# EAGLE schematic respirho2pilev2 (EAGLE 9.6.2)
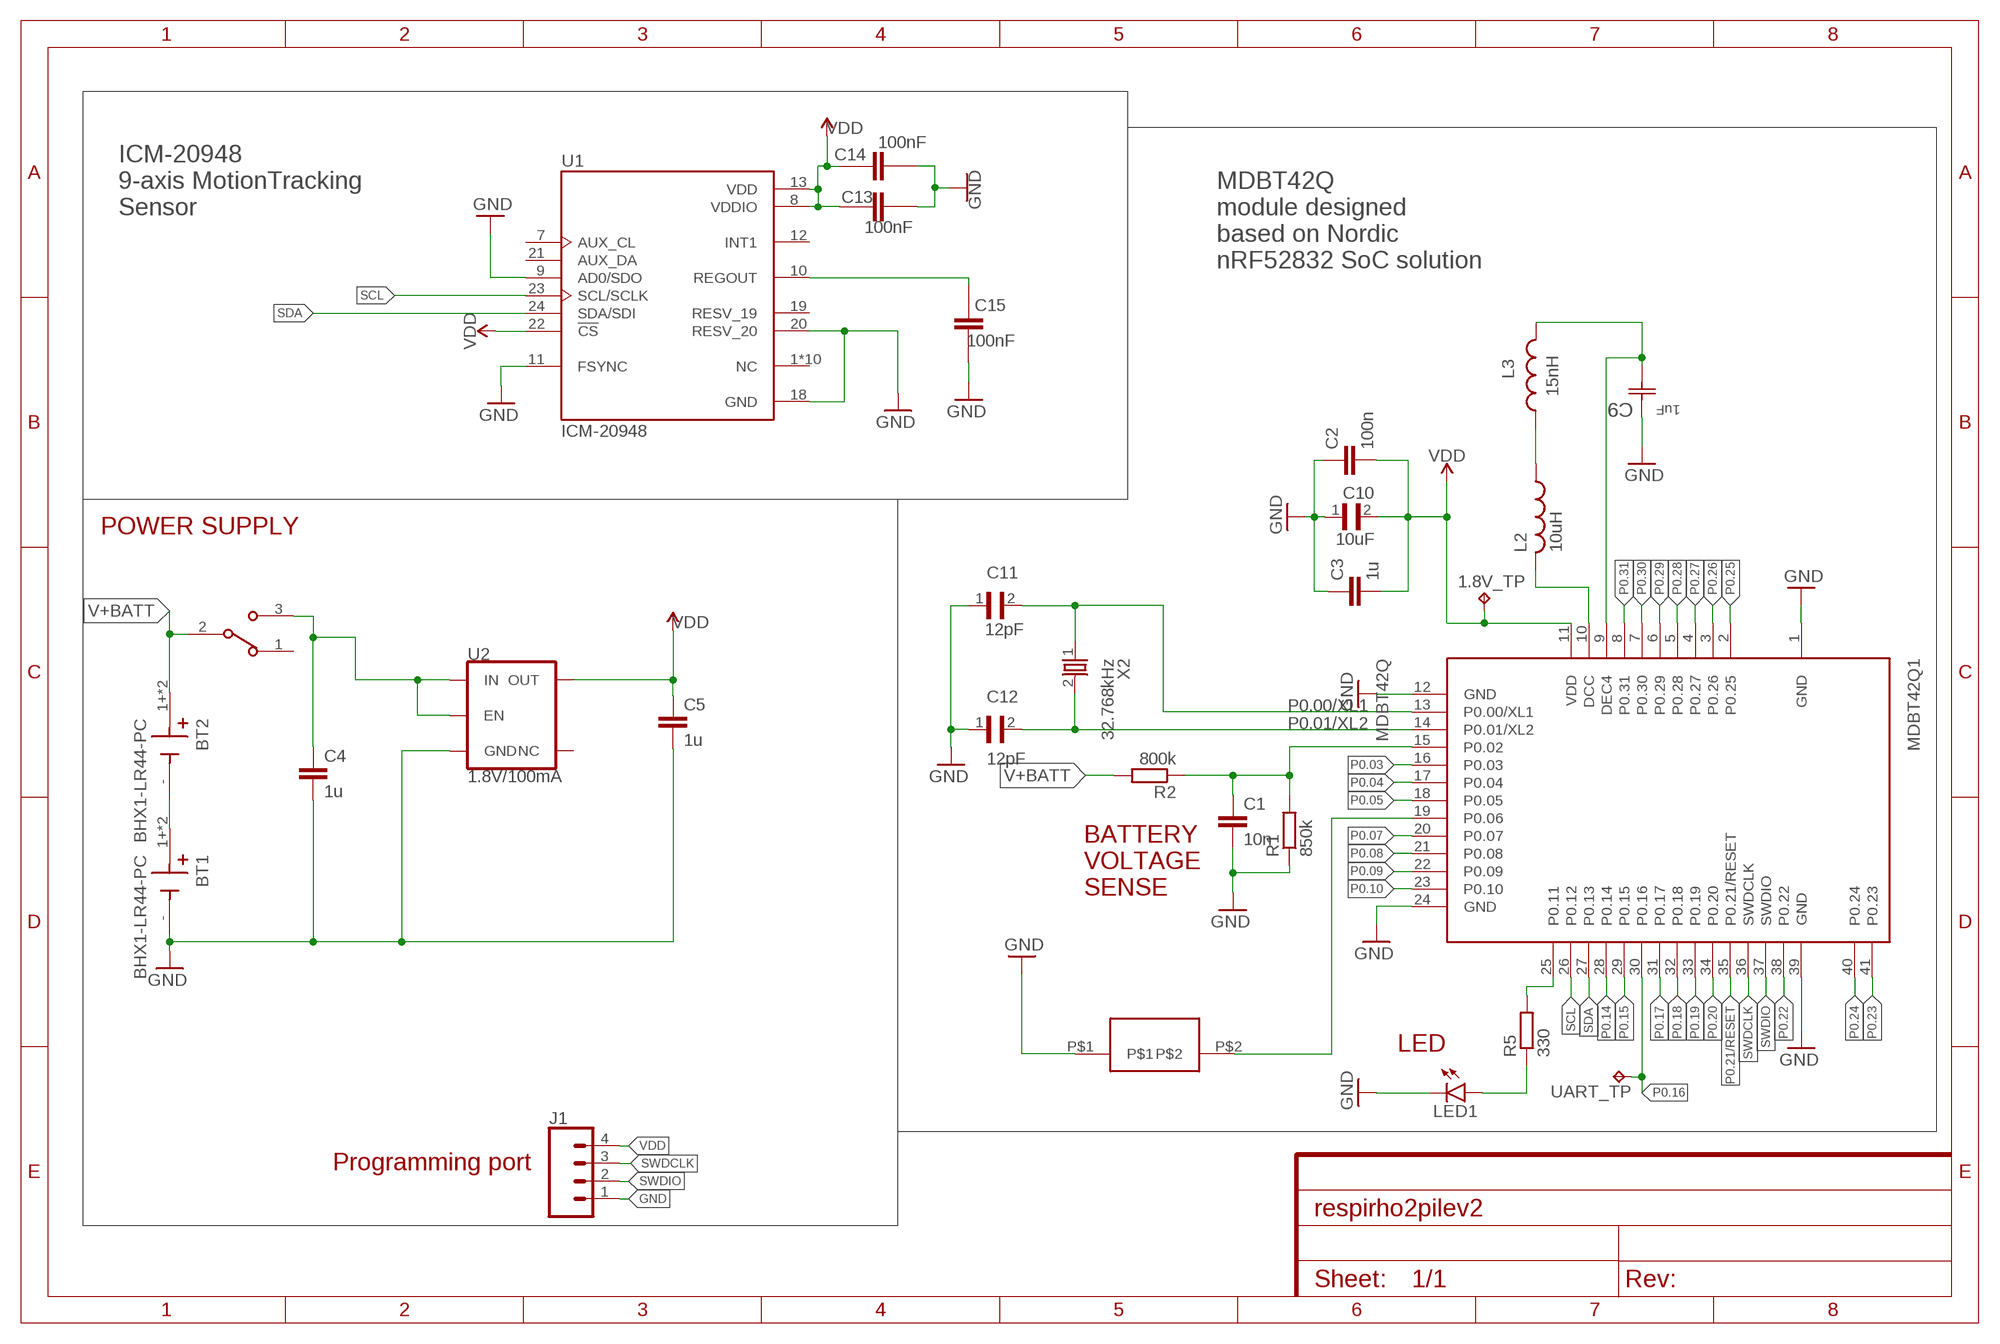
[diagram p0: schematic, sheet 1]

## Parts
1.8V_TP  TPB1,27  [B1,27]
BT1  BHX1-LR44-PC  [BAT_BHX1-LR44-PC]
BT2  BHX1-LR44-PC  [BAT_BHX1-LR44-PC]
C1  10n  C-EUC0603  [C0603]
C2  100n  C-EUC0402  [C0402]
C3  1u  C-EUC0603  [C0603]
C4  1u  C-EUC0402  [C0402]
C5  1u  C-EUC0402  [C0402]
C9  1uF  CC0603KRX7R7BB105  [CAPC1608X90N]
C10  10uF  GRM188R61A106KE69J  [CAPC1608X95N]
C11  12pF  04025A120GAT2A  [CAPC1005X56N]
C12  12pF  04025A120GAT2A  [CAPC1005X56N]
C13  100nF  CC0402KRX7R6BB104  [CAPC1005X60]
C14  100nF  CC0402KRX7R6BB104  [CAPC1005X60]
C15  100nF  CC0402KRX7R6BB104  [CAPC1005X60]
J1  CONN_04PTH  [1X04]
L2  10uH  INDUCTOR_0603_L  [RESC0603_L]
L3  15nH  LQG15HS15NJ02D  [INDC1005X55N]
LED1  LEDCHIPLED_1206  [CHIPLED_1206]
MDBT42Q1  MDBT42Q  [MDBT42Q]
R1  850k  R-EU_R0603  [R0603]
R2  800k  R-EU_R0603  [R0603]
R5  330  R-EU_R0603  [R0603]
S2  EG1213  [SW_EG1213]
U1  ICM-20948  [QFN40P300X300X105-24N]
U2  1.8V/100mA  V_REG_SP6214-1.8V  [SC70]
U$1  KSS231GLFS  [KSS231GLFS]
UART_TP  TPB1,27  [B1,27]
X2  32.768kHz  XTAL_32KHZ  [XTAL_3215_N]

## Nets
GND: BT1.- C1.2 C2.1 C3.1 C4.2 C5.2 C9.1(C1) C10.1 C11.1 C12.1 C13.1 C14.1 C15.1 J1.1 LED1.C MDBT42Q1.1(GND) MDBT42Q1.12(GND) MDBT42Q1.24(GND) MDBT42Q1.39(GND) R1.1 U1.9(AD0/SDO) U1.11(FSYNC) U1.18(GND) U1.20(RESV_20) U2.2(GND) U$1.P$1
N$1: LED1.A R5.1
N$2: L2.2 MDBT42Q1.10(DCC)
N$3: L2.1 L3.1
N$4: C9.2(C2) L3.2 MDBT42Q1.9(DEC4)
N$5: MDBT42Q1.25(P0.11) R5.2
N$6: BT1.1+(+) BT1.2+(+) BT2.-
N$7: C15.2 U1.10(REGOUT)
N$8: C4.1 S2.3 U2.1(IN) U2.3(EN)
N$9: C1.1 MDBT42Q1.15(P0.02) R1.2 R2.1
P0.00/XL1: C11.2 MDBT42Q1.13(P0.00/XL1) X2.1
P0.01/XL2: C12.2 MDBT42Q1.14(P0.01/XL2) X2.2
P0.03: MDBT42Q1.16(P0.03)
P0.04: MDBT42Q1.17(P0.04)
P0.05: MDBT42Q1.18(P0.05)
P0.07: MDBT42Q1.20(P0.07)
P0.08: MDBT42Q1.21(P0.08)
P0.09: MDBT42Q1.22(P0.09)
P0.10: MDBT42Q1.23(P0.10)
P0.14: MDBT42Q1.28(P0.14)
P0.15: MDBT42Q1.29(P0.15)
P0.16: MDBT42Q1.30(P0.16) UART_TP.TP
P0.17: MDBT42Q1.31(P0.17)
P0.18: MDBT42Q1.32(P0.18)
P0.19: MDBT42Q1.33(P0.19)
P0.20: MDBT42Q1.34(P0.20)
P0.21/RESET: MDBT42Q1.35(P0.21/RESET)
P0.22: MDBT42Q1.38(P0.22)
P0.23: MDBT42Q1.41(P0.23)
P0.24: MDBT42Q1.40(P0.24)
P0.25: MDBT42Q1.2(P0.25)
P0.26: MDBT42Q1.3(P0.26)
P0.27: MDBT42Q1.4(P0.27)
P0.28: MDBT42Q1.5(P0.28)
P0.29: MDBT42Q1.6(P0.29)
P0.30: MDBT42Q1.7(P0.30)
P0.31: MDBT42Q1.8(P0.31)
P06: MDBT42Q1.19(P0.06) U$1.P$2
SCL: MDBT42Q1.26(P0.12) U1.23(SCL/SCLK)
SDA: MDBT42Q1.27(P0.13) U1.24(SDA/SDI)
SWDCLK: J1.3 MDBT42Q1.36(SWDCLK)
SWDIO: J1.2 MDBT42Q1.37(SWDIO)
V+BATT: BT2.1+(+) BT2.2+(+) R2.2 S2.2
VDD: 1.8V_TP.TP C2.2 C3.2 C5.1 C10.2 C13.2 C14.2 J1.4 MDBT42Q1.11(VDD) U1.8(VDDIO) U1.13(VDD) U1.22(!CS) U2.5(OUT)
Unconnected: S2.1 U1.1(NC) U1.2(NC) U1.3(NC) U1.4(NC) U1.5(NC) U1.6(NC) U1.7(AUX_CL) U1.12(INT1) U1.14(NC) U1.15(NC) U1.16(NC) U1.17(NC) U1.19(RESV_19) U1.21(AUX_DA) U2.4(NC)

## Notes on the sheet
- ICM-20948
  9-axis MotionTracking
  Sensor
- MDBT42Q
  module designed 
  based on Nordic 
  nRF52832 SoC solution
- POWER SUPPLY
- BATTERY
  VOLTAGE
  SENSE
- LED
- Programming port

## Library data of the parts
1.8V_TP UART_TP = testpad:TP: Test pad
BT1 BT2 = BHX1-LR44-PC:BHX1-LR44-PC: Battery Retainer Coin, 12.0mm 1 Cell PC Pin; DESCRIPTION: Battery Retainer Coin, 12.0mm 1 Cell PC Pin; DIGI-KEY_PART_NUMBER: BHX1-LR44-PC-G-ND; MF: MPD; MP: BHX1-LR44-PC; PACKAGE: None; PURCHASE-URL: https://pricing.snapeda.com/search/part/BHX1-LR44-PC/?ref=eda
C1-C5 = rcl:C-EU: CAPACITOR, European symbol; SPICEPREFIX: C
C9 = CC0603KRX7R7BB105:CC0603KRX7R7BB105: CAPACITOR, 0603; DESCRIPTION: 0603 1 uF 16 V ±10 % Tolerance X7R SMT Multilayer Ceramic Capacitor; DIGI-KEY_PART_NUMBER: 311-1446-1-ND; DIGI-KEY_PURCHASE_URL: https://www.digikey.com/product-detail/en/yageo/CC0603KRX7R7BB105/311-1446-1-ND/2833752?utm_source=snapeda&utm_medium=aggregator&utm_campaign=symbol; MF: Yageo; MP: CC0603KRX7R7BB105; PACKAGE: 0603 Yageo
C10 = GRM188R61A106KE69J:GRM188R61A106KE69J: Cap Ceramic 10uF 10V X5R 10% SMD 0603 85°C Paper T/R; DESCRIPTION: SMD Capacitor X5R_EIA_ with Capacitance: 10uF Tol. 10%. Rated Voltage: 10Vdc; DIGI-KEY_PART_NUMBER: 490-14372-1-ND; DIGI-KEY_PURCHASE_URL: https://www.digikey.com/product-detail/en/murata-electronics/GRM188R61A106KE69J/490-14372-1-ND/6606833?utm_source=snapeda&utm_medium=aggregator&utm_campaign=symbol; MF: Murata; MP: GRM188R61A106KE69J; PACKAGE: 1608 Murata
C11 C12 = 04025A120GAT2A:04025A120GAT2A: CAP, MLCC, C0G, 12PF, 50V, 0402; DESCRIPTION: 0402 12 pF 50 V ±2% Tolerance C0G/NP0 SMT Multilayer Ceramic Capacitor; DIGI-KEY_PART_NUMBER: 478-7871-1-ND; DIGI-KEY_PURCHASE_URL: https://www.digikey.com/product-detail/en/avx-corporation/04025A120GAT2A/478-7871-1-ND/3881494?utm_source=snapeda&utm_medium=aggregator&utm_campaign=symbol; MF: AVX; MP: 04025A120GAT2A; PACKAGE: 1005 AVX
C13-C15 = CC0402KRX7R6BB104:CC0402KRX7R6BB104: Capacitor 100nF 10V 0402 SMD X7R (reel); DESCRIPTION: 0.1µF ±10% 10V Ceramic Capacitor X7R 0402 _1005 Metric_; DIGI-KEY_PART_NUMBER: 311-1345-1-ND; DIGI-KEY_PURCHASE_URL: https://www.digikey.com/product-detail/en/yageo/CC0402KRX7R6BB104/311-1345-1-ND/2103129?utm_source=snapeda&utm_medium=aggregator&utm_campaign=symbol; MF: Yageo; MP: CC0402KRX7R6BB104; PACKAGE: 0402 Yageo
J1 = SparkFun-Connectors:CONN_04: Multi connection point. Often used as Generic Header-pin footprint for 0.1 inch spaced/style header connections On any of the 0.1 inch spaced packages, you can populate with these: Break Away Headers - Straight <https://www.sparkfun.com/products/116> (PRT-00116) Break Away Male Headers - Right Angle <https://www.sparkfun.com/products/553> (PRT-00553) Female Headers <https://www.sparkfun.com/products/115> (PRT-00115) Break Away Headers - Machine Pin <https://www.sparkfun.com/products/117> (PRT-00117) Break Away Female Headers - Swiss Machine Pin <https://www.sparkfun.com/products/743> (PRT-00743) For SCREWTERMINALS and SPRING TERMINALS visit here: Screw Terimnals on SparkFun.com <https://www.sparkfun.com/search/results?term=Screw+Terminals> (5mm/3.5mm/2.54mm spacing) This device is also useful as a general connection point to wire up your design to another part of your project. Our various solder wires solder well into these plated through hole pads. Hook-Up Wire - Assortment (Stranded, 22 AWG) <https://www.sparkfun.com/products/11375> (PRT-11375) Hook-Up Wire - Assortment (Solid Core, 22 AWG) <https://www.sparkfun.com/products/11367> (PRT-11367) View the entire wire category on our website here <https://www.sparkfun.com/categories/141> Special notes: Molex polarized connector foot print use with SKU : PRT-08231 with associated crimp pins and housings. 1MM SMD Version SKU: PRT-10208; PROD_ID: CONN-09696
L2 = Nordic_nRF:INDUCTOR: Generic chip inductor
L3 = LQG15HS15NJ02D:LQG15HS15NJ02D: Ind RF Chip Multi-Layer 15nH 5% 100MHz 8Q-Factor Air 300mA 0402 Paper T/R; DESCRIPTION: Inductor with Inductance: 15nH Tol. +/-5%, Package: 0402 _1005_; DIGI-KEY_PART_NUMBER: 490-2625-1-ND; DIGI-KEY_PURCHASE_URL: https://www.digikey.com/product-detail/en/murata-electronics/LQG15HS15NJ02D/490-2625-1-ND/662905?utm_source=snapeda&utm_medium=aggregator&utm_campaign=symbol; MF: Murata Electronics; MP: LQG15HS15NJ02D; PACKAGE: 1005 Murata
LED1 = led:LED: LED OSRAM: - CHIPLED LG R971, LG N971, LY N971, LG Q971, LY Q971, LO R971, LY R971 LH N974, LH R974 LS Q976, LO Q976, LY Q976 LO Q996 - Hyper CHIPLED LW Q18S LB Q993, LB Q99A, LB R99A - SideLED LS A670, LO A670, LY A670, LG A670, LP A670 LB A673, LV A673, LT A673, LW A673 LH A674 LY A675 LS A676, LA A676, LO A676, LY A676, LW A676 LS A679, LY A679, LG A679 - Hyper Micro SIDELED® LS Y876, LA Y876, LO Y876, LY Y876 LT Y87S - SmartLED LW L88C, LW L88S LB L89C, LB L89S, LG L890 LS L89K, LO L89K, LY L89K LS L896, LA L896, LO L896, LY L896 - TOPLED LS T670, LO T670, LY T670, LG T670, LP T670 LSG T670, LSP T670, LSY T670, LOP T670, LYG T670 LG T671, LOG T671, LSG T671 LB T673, LV T673, LT T673, LW T673 LH T674 LS T676, LA T676, LO T676, LY T676, LB T676, LH T676, LSB T676, LW T676 LB T67C, LV T67C, LT T67C, LS T67K, LO T67K, LY T67K, LW E67C LS E67B, LA E67B, LO E67B, LY E67B, LB E67C, LV E67C, LT E67C LW T67C LS T679, LY T679, LG T679 LS T770, LO T770, LY T770, LG T770, LP T770 LB T773, LV T773, LT T773, LW T773 LH T774 LS E675, LA E675, LY E675, LS T675 LS T776, LA T776, LO T776, LY T776, LB T776 LHGB T686 LT T68C, LB T68C - Hyper Mini TOPLED® LB M676 - Mini TOPLED Santana® LG M470 LS M47K, LO M47K, LY M47K Source: http://www.osram.convergy.de LUXEON: - LUMILED® LXK2-PW12-R00, LXK2-PW12-S00, LXK2-PW14-U00, LXK2-PW14-V00 LXK2-PM12-R00, LXK2-PM12-S00, LXK2-PM14-U00 LXK2-PE12-Q00, LXK2-PE12-R00, LXK2-PE12-S00, LXK2-PE14-T00, LXK2-PE14-U00 LXK2-PB12-K00, LXK2-PB12-L00, LXK2-PB12-M00, LXK2-PB14-N00, LXK2-PB14-P00, LXK2-PB14-Q00 LXK2-PR12-L00, LXK2-PR12-M00, LXK2-PR14-Q00, LXK2-PR14-R00 LXK2-PD12-Q00, LXK2-PD12-R00, LXK2-PD12-S00 LXK2-PH12-R00, LXK2-PH12-S00 LXK2-PL12-P00, LXK2-PL12-Q00, LXK2-PL12-R00 Source: www.luxeon.com KINGBRIGHT: KA-3528ASYC Source: www.kingbright.com
MDBT42Q1 = MDBT42Q_171016:MDBT42Q: Raytac Corporation MDBT42Q-512K, MDBT42Q-P512K Bluetooth Low Energy Module based on Noridc nRF52832 Source: Raytac datasheet
R1 R2 R5 = rcl:R-EU_: RESISTOR, European symbol; SPICEPREFIX: R
S2 = Slide_switch:EG1213: EG Series SPDT On-On Right Angle Through Hole Slide Switch; DESCRIPTION: Slide Switch SPDT Through Hole, Right Angle; DIGI-KEY_PART_NUMBER: EG1906-ND; MF: E-Switch; MP: EG1213; PACKAGE: None; PURCHASE-URL: https://pricing.snapeda.com/search/part/EG1213/?ref=eda
U1 = ICM-20948:ICM-20948: Accelerometer, Gyroscope, Magnetometer, 9 Axis Sensor I²C, SPI Output Check prices <https://pricing.snapeda.com/parts/ICM-20948/TDK%20InvenSense/view-part?ref=eda>; AVAILABILITY: Good; DESCRIPTION: Accelerometer, Gyroscope, Magnetometer, 9 Axis Sensor I²C, SPI Output; MF: TDK InvenSense; MP: ICM-20948; PACKAGE: TFQFN-24 TDK InvenSense; PRICE: None; PURCHASE-URL: https://pricing.snapeda.com/search/part/ICM-20948/?ref=eda
U2 = SparkFun-IC-Power:V_REG_SP6214: Voltage Regulator - SP6214 SP6214 Series SC-70-5 Micropower SC-70 100 mA CMOS LDO Regulator Datasheet <https://www.exar.com/content/document.ashx?id=654> SparkFun Products: MP3 Trigger <https://www.sparkfun.com/products/13720> SparkFun Particle Sensor Breakout <https://www.sparkfun.com/products/14045>; PROD_ID: VREG-08428
U$1 = KSS231GLFS:KSS231GLFS
X2 = Nordic_nRF:XTAL_32KHZ